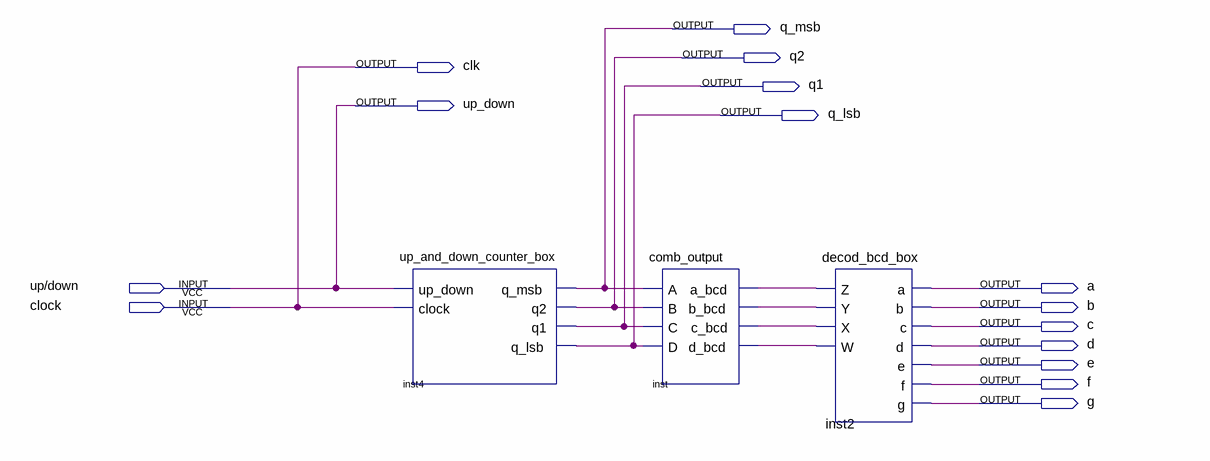
[diagram p0: schematic sheet]
// Quartus schematic up_and_down_counter.bdf as structural Verilog: 3 symbols, 15 pins
module up_and_down_counter (
  input  \up/down ,
  input  clock,
  output q_msb,
  output q2,
  output clk,
  output q1,
  output up_down,
  output q_lsb,
  output a,
  output b,
  output c,
  output d,
  output e,
  output f,
  output g
);

  wire inst_a_bcd, inst_b_bcd, inst_c_bcd, inst_d_bcd;

  up_and_down_counter_box inst4 (.up_down(\up/down ), .clock(clock), .q_msb(q_msb), .q2(q2), .q1(q1), .q_lsb(q_lsb));
  comb_output inst (
    .A(q_msb), .B(q2), .C(q1), .D(q_lsb), .a_bcd(inst_a_bcd), .b_bcd(inst_b_bcd), .c_bcd(inst_c_bcd),
    .d_bcd(inst_d_bcd));
  decod_bcd_box inst2 (
    .Z(inst_a_bcd), .Y(inst_b_bcd), .X(inst_c_bcd), .W(inst_d_bcd), .a(a), .b(b), .c(c), .d(d), .e(e), .f(f),
    .g(g));

  assign clk = clock;
  assign up_down = \up/down ;
endmodule
